# Altium schematic sheet CAN_ChaseCar.SchDoc
size A4
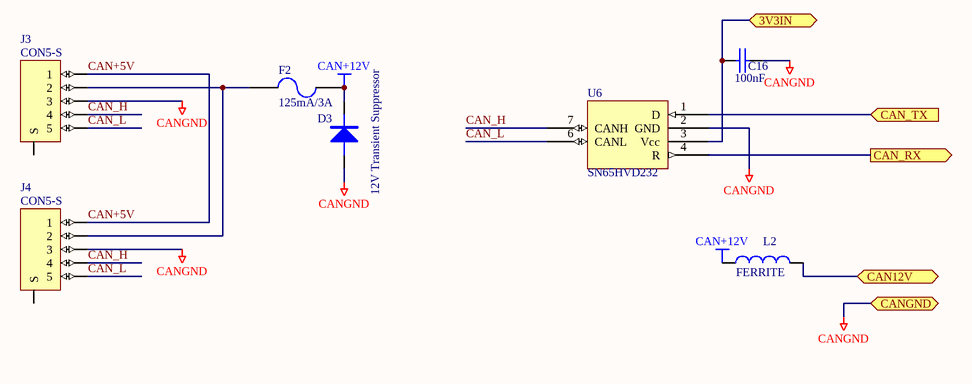
[diagram p0: CAN_ChaseCar.SchDoc]

## Parts
C16  100nF  [0603]
D3  12V Transient Suppressor  [SMA]
F2  125mA/3A  [LITTELFUSE-154]
J3  CON5-S  [TRIAD5F]
J4  CON5-S  [TRIAD5F]
L2  FERRITE  [0603]
U6  SN65HVD232  [SO8]

## Ports
3V3IN, CAN12V, CAN_RX (out), CAN_TX (in), CANGND

## Nets
CAN+12V: D3.K F2.2 L2.1
CANGND: C16.1 D3.A J3.3 J4.3 U6.2(GND) ; port CANGND
3V3IN: C16.2 U6.3(Vcc) ; port 3V3IN
CAN12V: L2.2 ; port CAN12V
CAN+5V: J3.1 J4.1
CAN_H: J3.4 J4.4 U6.7(CANH)
CAN_L: J3.5 J4.5 U6.6(CANL)
CAN_RX: U6.4(R) ; port CAN_RX
CAN_TX: U6.1(D) ; port CAN_TX
NetF2_1: F2.1 J3.2 J4.2

Not connected (* = marked no-connect by the designer): J3 0(S); J4 0(S)

## Library data of the parts
C16 = CAP: Capacitor; Needed?: NO - HW LAB; Value: 100nF
D3 = DIODE: Needed?: NO - Workshop; Farnell: 302-3096; Farnell Price: 1.25
F2 = FUSE2: Fuse; Needed?: NO - Workshop; Farnell: 664-893; Other Info: www.littelfuse.com; Farnell Price: 5.67
J3 J4 = CON5-S: Connector, 2 pin, with shield @ S; Needed?: NO - Workshop; Farnell Price: 19.32
L2 = INDUCTOR: Manufacturer: Generic Components; Revision: July-2002: Re-released for DXP Platform.; Element14: 1308773; Element14 Price: 0.72
U6 = SN65HVD232: 3.3V CAN Transciever; Needed?: Unsure - RS; RS: 461-9771; RS Price: 3.81; Farnell: 1103107; Farnell Price: 5.10